# EAGLE design PSoC_PyunPyun_Mini (EAGLE 7.2.0)
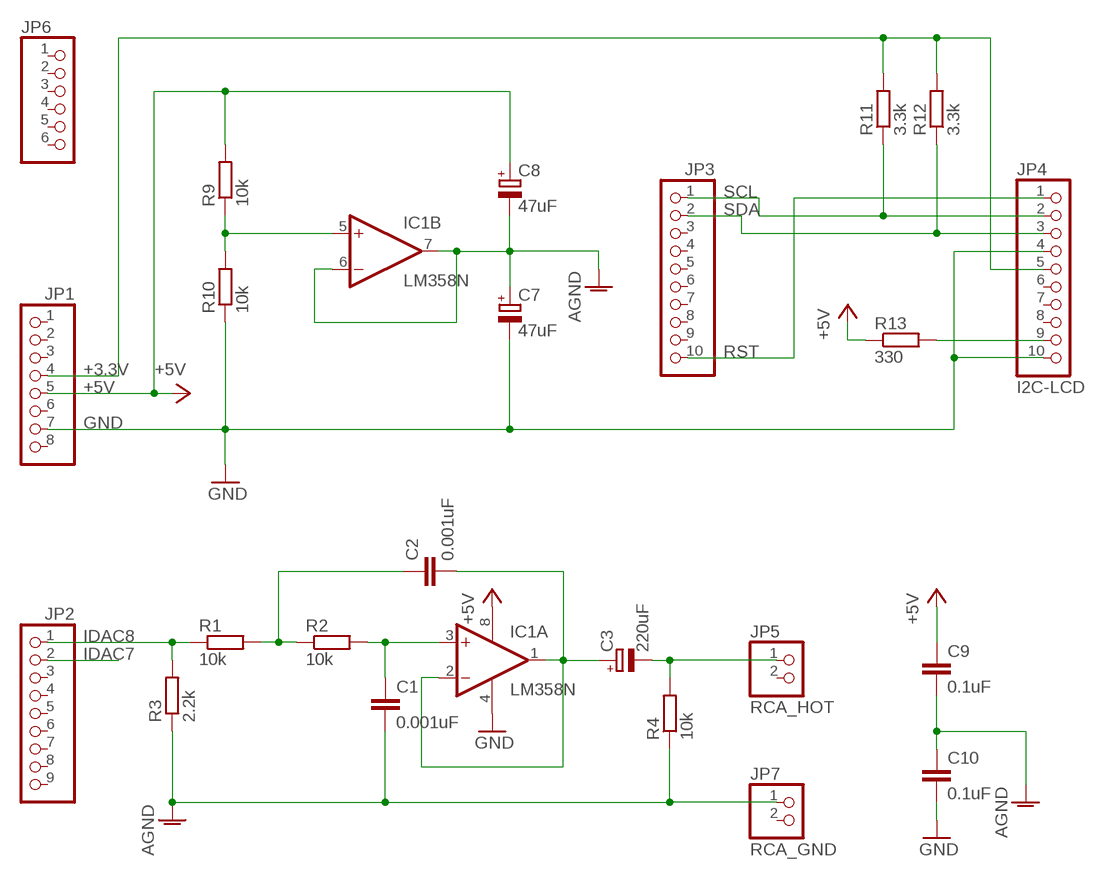
[diagram p0: schematic, sheet 1]

## Parts
C1  0.001uF  C-EU050-024X044  [C050-024X044]
C2  0.001uF  C-EU050-024X044  [C050-024X044]
C3  220uF  CPOL-EUE5-8.5  [E5-8,5]
C7  47uF  CPOL-EUE5-5  [E5-5]
C8  47uF  CPOL-EUE5-5  [E5-5]
C9  0.1uF  C-EU050-024X044  [C050-024X044]
C10  0.1uF  C-EU050-024X044  [C050-024X044]
IC1  LM358N  [DIL08]
JP1  PINHD-1X8  [1X08]
JP2  PINHD-1X9  [1X09]
JP3  PINHD-1X10  [1X10]
JP4  I2C-LCD  PINHD-1X10  [1X10]
JP5  RCA_HOT  PINHD-1X2  [1X02]
JP6  PINHD-1X6  [1X06]
JP7  RCA_GND  PINHD-1X2  [1X02]
R1  10k  R-EU_0207/7  [0207/7]
R2  10k  R-EU_0207/7  [0207/7]
R3  2.2k  R-EU_0207/7  [0207/7]
R4  10k  R-EU_0207/7  [0207/7]
R9  10k  R-EU_0207/7  [0207/7]
R10  10k  R-EU_0207/7  [0207/7]
R11  3.3k  R-EU_0207/7  [0207/7]
R12  3.3k  R-EU_0207/7  [0207/7]
R13  330  R-EU_0207/7  [0207/7]

## Nets
+3.3V: JP1.4 JP4.5 R11.2 R12.2
+5V: C8.+ C9.1 IC1.8(P:V+) JP1.5 R9.2 R13.1
AGND: C1.2 C7.+ C8.- C9.2 C10.1 IC1.6(B:-IN) IC1.7(B:OUT) JP7.1 R3.1 R4.1
GND: C7.- C10.2 IC1.4(P:V-) JP1.7 JP4.4 JP4.10 R10.1
IDAC7: JP2.2
IDAC8: JP2.1 R1.1 R3.2
N$1: C2.1 R1.2 R2.1
N$3: C1.1 IC1.3(A:+IN) R2.2
N$4: C2.2 C3.+ IC1.1(A:OUT) IC1.2(A:-IN)
N$5: JP4.9 R13.2
N$7: C3.- JP5.1 R4.2
N$8: IC1.5(B:+IN) R9.1 R10.2
RST: JP3.10 JP4.1
SCL: JP3.1 JP4.2 R11.1
SDA: JP3.2 JP4.3 R12.1
Unconnected: JP1.1 JP1.2 JP1.3 JP1.6 JP1.8 JP2.3 JP2.4 JP2.5 JP2.6 JP2.7 JP2.8 JP2.9 JP3.3 JP3.4 JP3.5 JP3.6 JP3.7 JP3.8 JP3.9 JP4.6 JP4.7 JP4.8 JP5.2 JP6.1 JP6.2 JP6.3 JP6.4 JP6.5 JP6.6 JP7.2

## Library data of the parts
C1 C2 C9 C10 = rcl:C-EU: CAPACITOR, European symbol
C3 C7 C8 = rcl:CPOL-EU: POLARIZED CAPACITOR, European symbol
IC1 = linear:LM358: OP AMP also LM158; LM258; LM2904 Source: http://cache.national.com/ds/LM/LM158.pdf
JP1 = pinhead:PINHD-1X8: PIN HEADER
JP2 = pinhead:PINHD-1X9: PIN HEADER
JP3 JP4 = pinhead:PINHD-1X10: PIN HEADER
JP5 JP7 = pinhead:PINHD-1X2: PIN HEADER
JP6 = pinhead:PINHD-1X6: PIN HEADER
R1-R4 R9-R13 = rcl:R-EU_: RESISTOR, European symbol

## Board
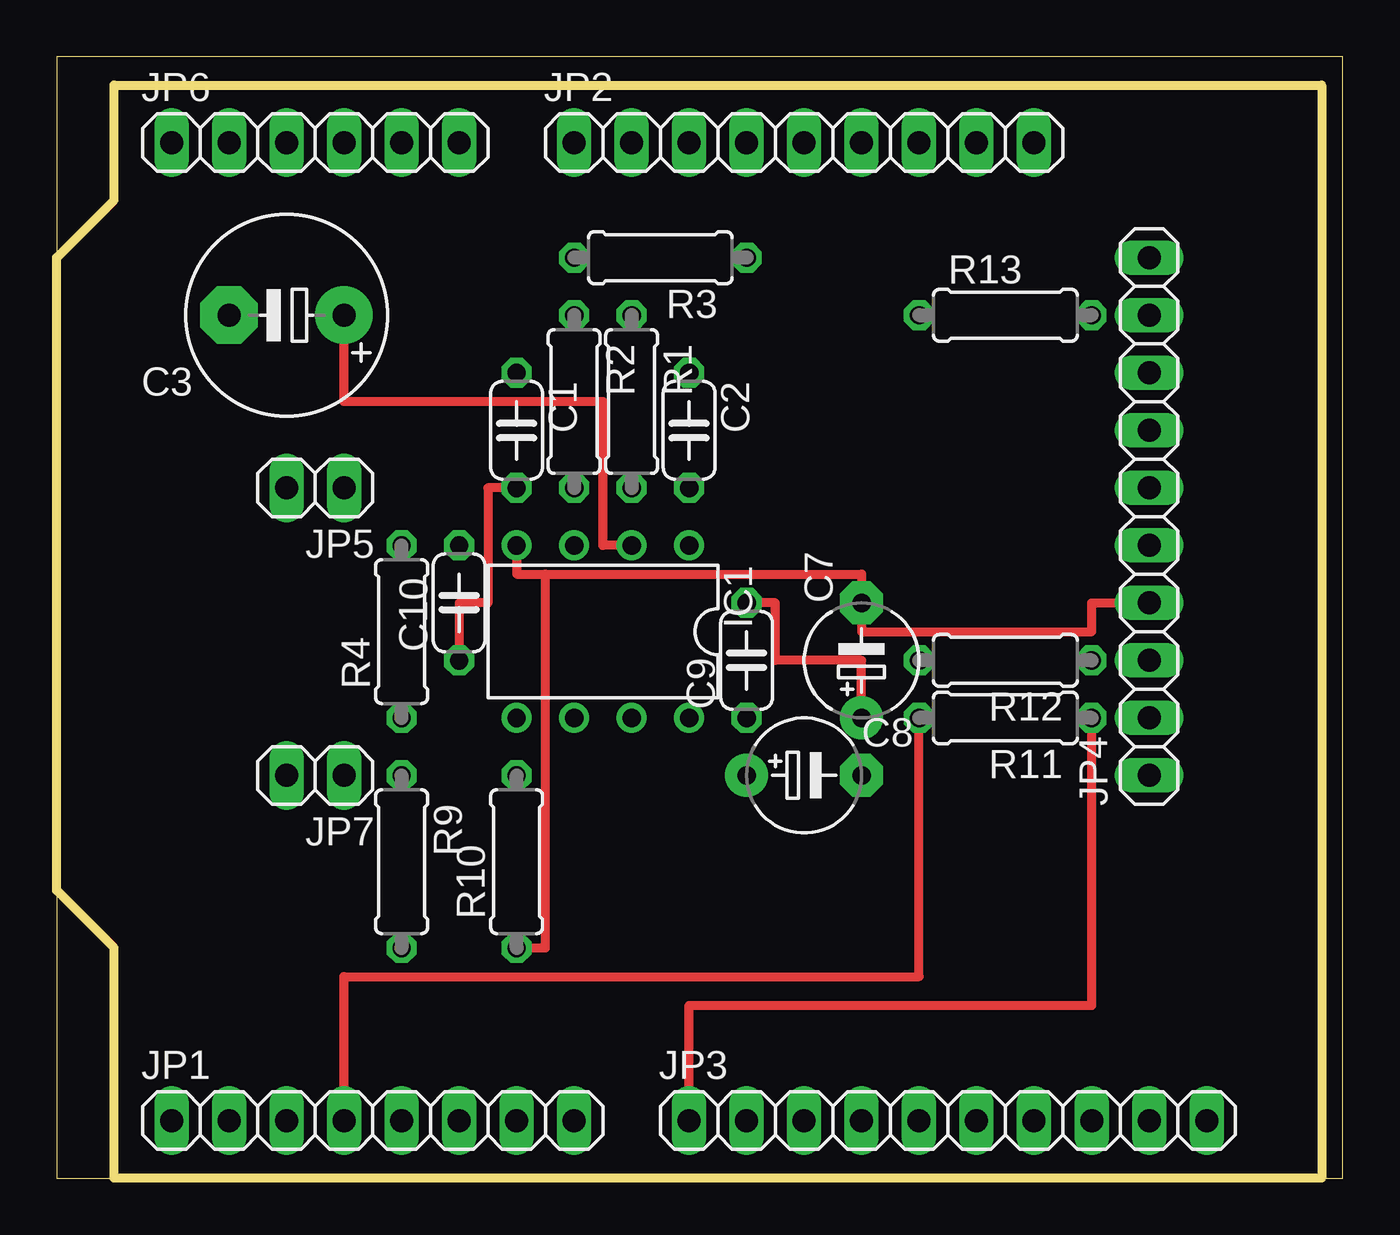
[diagram p1: board, top side]
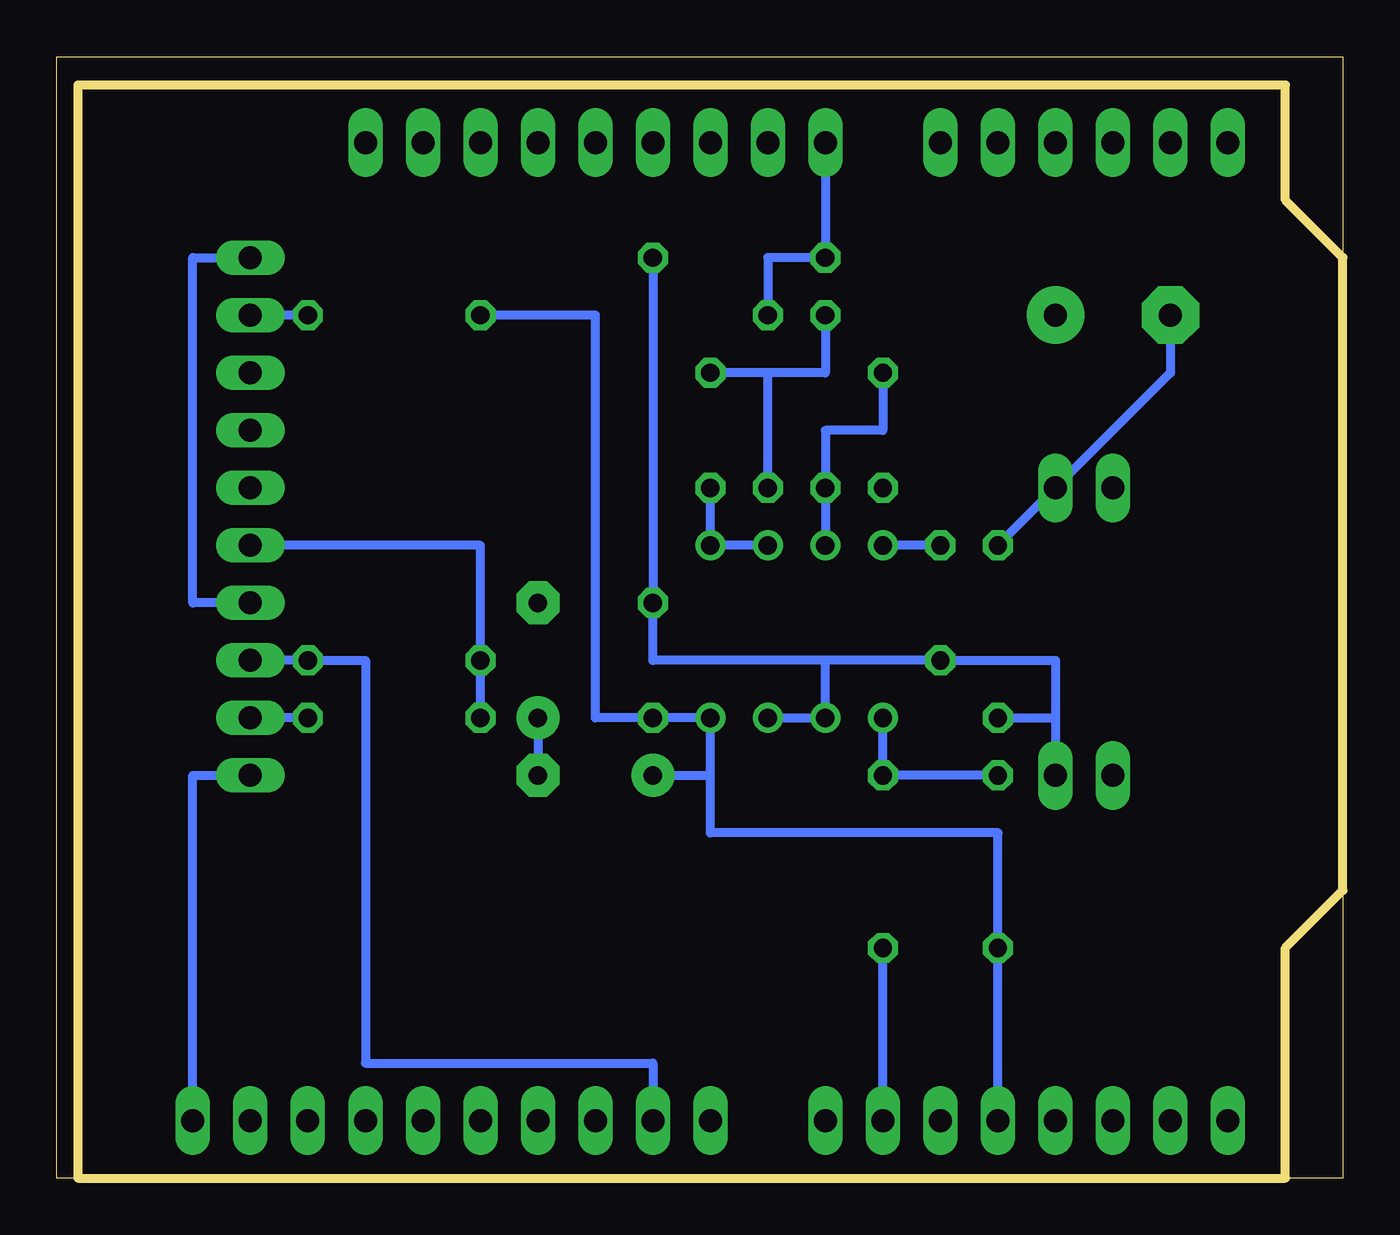
[diagram p2: board, bottom side, seen from below]

Size 56.82 x 49.52 mm. Coordinates in mm from the lower left corner, seen from the top.
Outline: 2.54,0 0,0 0,12.7
Outline: 55.88,0 56.82,0 56.82,49.52 0,49.52 0,40.64
Outline: 0,12.7 0,40.64
Outline: 0,40.64 2.54,43.18 2.54,48.26 55.88,48.26 55.88,0
Outline: 55.88,0 2.54,0
Outline: 2.54,0 2.54,10.16 0,12.7
Copper layers (1*16): Top 0.035mm / dielectric 1.5mm / Bottom 0.035mm
Design rules "default": minimum track width 10mil, minimum drill 24mil, track to track 8mil, track to pad 8mil, pad to pad 8mil, via to via 8mil, smd to smd 8mil, copper to edge 40mil, drill to drill 8mil, minimum pad ring 10mil, minimum via ring 8mil, stop-mask expansion 4mil, vias tented up to drill 0mil, thermal gap 10mil
tKeepout: area -2.5,16.5 to 14,31.8

### Footprints (pad centres in the part's own frame; a part is rotated, then mirrored left to right if it is on the bottom)
C050-024X044 = drill 0.813 octagon: 1 -2.54,0; 2 2.54,0
E5-8,5 = drill 1.016 pad 2.54: + -2.54,0 | drill 1.016 pad 2.54 octagon: - 2.54,0
E5-5 = drill 0.813 pad 1.905: + -2.54,0 | drill 0.813 pad 1.905 octagon: - 2.54,0
DIL08 = drill 0.813 pad 1.27: 1 -3.81,-3.81; 2 -1.27,-3.81; 3 1.27,-3.81; 4 3.81,-3.81; 5 3.81,3.81; 6 1.27,3.81; 7 -1.27,3.81; 8 -3.81,3.81
1X08 = drill 1.016 long: 1 -8.89,0; 2 -6.35,0; 3 -3.81,0; 4 -1.27,0; 5 1.27,0; 6 3.81,0; 7 6.35,0; 8 8.89,0
1X09 = drill 1.016 long: 1 -10.16,0; 2 -7.62,0; 3 -5.08,0; 4 -2.54,0; 5 0,0; 6 2.54,0; 7 5.08,0; 8 7.62,0; 9 10.16,0
1X10 = drill 1.016 long: 1 -11.43,0; 2 -8.89,0; 3 -6.35,0; 4 -3.81,0; 5 -1.27,0; 6 1.27,0; 7 3.81,0; 8 6.35,0; 9 8.89,0; 10 11.43,0
1X02 = drill 1.016 long: 1 -1.27,0; 2 1.27,0
1X06 = drill 1.016 long: 1 -6.35,0; 2 -3.81,0; 3 -1.27,0; 4 1.27,0; 5 3.81,0; 6 6.35,0
0207/7 = drill 0.813 octagon: 1 -3.81,0; 2 3.81,0

### Placement (x,y rotation side)
C1  20.32,33.02 270 top
C2  27.94,33.02 270 top
C3  10.16,38.1 180 top
C7  35.56,22.86 90 top
C8  33.02,17.78 0 top
C9  30.48,22.86 90 top
C10  17.78,25.4 90 top
IC1  24.13,24.13 180 top
JP1  13.97,2.54 0 top
JP2  33.02,45.72 0 top
JP3  39.37,2.54 0 top
JP4  48.26,29.21 90 top
JP5  11.43,30.48 180 top
JP6  11.43,45.72 0 top
JP7  11.43,17.78 180 top
R1  25.4,34.29 270 top
R2  22.86,34.29 270 top
R3  26.67,40.64 180 top
R4  15.24,24.13 90 top
R9  15.24,13.97 270 top
R10  20.32,13.97 90 top
R11  41.91,20.32 180 top
R12  41.91,22.86 180 top
R13  41.91,38.1 0 top

### Tracks (layer width: path | path; a pad name or v marks a point on that pad's centre or on a via)
+3.3V
  Top 0.406: JP1.4 12.7,8.89 38.1,8.89 R11.2
  Bottom 0.406: R11.2 R12.2 38.1,27.94 JP4.5
+5V
  Bottom 0.406: JP1.5 R9.2 15.24,15.24 27.94,15.24 27.94,17.78 | 27.94,17.78 IC1.8 C9.1 33.02,20.32 33.02,38.1 R13.1 | C8.+ 27.94,17.78
AGND
  Top 0.406: C1.2 19.05,30.48 19.05,25.4 17.78,25.4 C10.1 | C7.+ 35.56,22.86 31.75,22.86 31.75,25.4 C9.2
  Bottom 0.406: 12.7,20.32 12.7,22.86 C10.1 22.86,22.86 | 12.7,20.32 JP7.1 | R4.1 12.7,20.32 | C7.+ C8.- | 22.86,22.86 30.48,22.86 C9.2 R3.1 | IC1.7 IC1.6 22.86,22.86
GND
  Top 0.406: IC1.4 20.32,26.67 21.59,26.67 | 21.59,26.67 35.56,26.67 C7.- 35.56,24.13 45.72,24.13 45.72,25.4 JP4.4 | R10.1 21.59,10.16 21.59,26.67
  Bottom 0.406: JP1.7 R10.1 | C10.2 IC1.4 | JP4.4 50.8,25.4 50.8,40.64 JP4.10
IDAC8
  Bottom 0.406: R1.1 25.4,40.64 R3.2 JP2.1
N$1
  Bottom 0.406: R2.1 22.86,35.56 25.4,35.56 | 25.4,35.56 C2.1 | R1.2 25.4,35.56
N$3
  Bottom 0.406: IC1.3 R2.2 22.86,33.02 20.32,33.02 C1.1
N$4
  Top 0.406: IC1.2 24.13,27.94 24.13,34.29 12.7,34.29 C3.+
  Bottom 0.406: IC1.2 IC1.1 C2.2
N$5
  Bottom 0.406: R13.2 JP4.9
N$7
  Bottom 0.406: R4.2 JP5.1 7.62,35.56 C3.-
N$8
  Bottom 0.406: R9.1 R10.2 IC1.5
RST
  Bottom 0.406: JP3.10 50.8,17.78 JP4.1
SCL
  Top 0.406: JP3.1 27.94,7.62 45.72,7.62 R11.1
  Bottom 0.406: R11.1 JP4.2
SDA
  Bottom 0.406: JP4.3 R12.1 43.18,22.86 43.18,5.08 30.48,5.08 JP3.2